# Altium project rmi-hw.PrjPcb
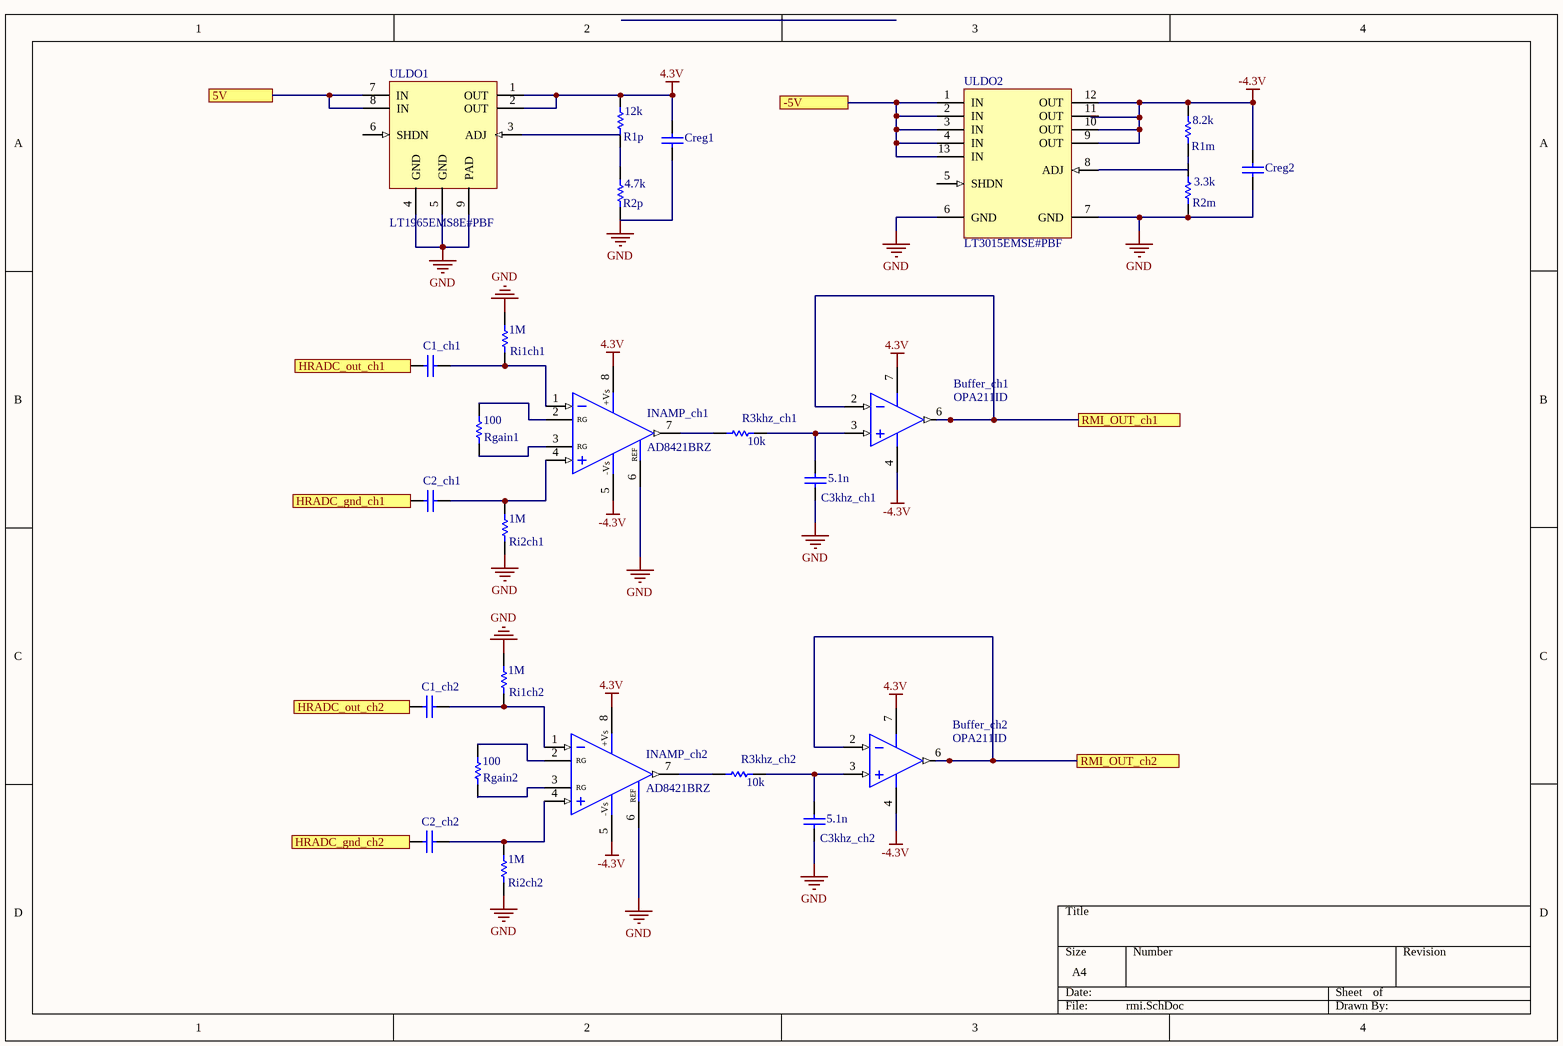
[diagram p0: rmi.SchDoc]
1 sheet, 26 parts. Net scope: flat (ports and power ports of the same name join across sheets).

## Sheet rmi.SchDoc
size A4; SheetNumber: 1; SheetTotal: 1

### Parts
Buffer_ch1  OPA211ID  [SOIC_8_N]
Buffer_ch2  OPA211ID  [SOIC_8_N]
C1_ch1  Cap_Ceram_0603  [CAP_CERAM_0603]  (value not drawn)
C1_ch2  Cap_Ceram_0603  [CAP_CERAM_0603]  (value not drawn)
C2_ch1  Cap_Ceram_0603  [CAP_CERAM_0603]  (value not drawn)
C2_ch2  Cap_Ceram_0603  [CAP_CERAM_0603]  (value not drawn)
C3khz_ch1  value 5.1n  [CAP_CERAM_0603]  (hidden comment: Cap_Ceram_0603)
C3khz_ch2  value 5.1n  [CAP_CERAM_0603]  (hidden comment: Cap_Ceram_0603)
Creg1  Cap_Ceram_0603  [CAP_CERAM_0603]  (value not drawn)
Creg2  Cap_Ceram_0603  [CAP_CERAM_0603]  (value not drawn)
INAMP_ch1  AD8421BRZ  [SOIC_8_L]
INAMP_ch2  AD8421BRZ  [SOIC_8_L]
R1m  value 8.2k  [R_0603]  (hidden comment: Res_0603)
R1p  value 12k  [R_0603]  (hidden comment: Res_0603)
R2m  value 3.3k  [R_0603]  (hidden comment: Res_0603)
R2p  value 4.7k  [R_0603]  (hidden comment: Res_0603)
R3khz_ch1  value 10k  [R_0603]  (hidden comment: Res_0603)
R3khz_ch2  value 10k  [R_0603]  (hidden comment: Res_0603)
Rgain1  value 100  [R_0603]  (hidden comment: Res_0603)
Rgain2  value 100  [R_0603]  (hidden comment: Res_0603)
Ri1ch1  value 1M  [R_0603]  (hidden comment: Res_0603)
Ri1ch2  value 1M  [R_0603]  (hidden comment: Res_0603)
Ri2ch1  value 1M  [R_0603]  (hidden comment: Res_0603)
Ri2ch2  value 1M  [R_0603]  (hidden comment: Res_0603)
ULDO1  LT1965EMS8E#PBF  [MSOP8-EP3]
ULDO2  LT3015EMSE#PBF  [MSOP12-EP]

### Ports
5V, -5V, HRADC_gnd_ch1, HRADC_gnd_ch2, HRADC_out_ch1, HRADC_out_ch2, RMI_OUT_ch1, RMI_OUT_ch2

### Nets
4.3V: Buffer_ch1.7(V+) Buffer_ch2.7(V+) Creg1.2 INAMP_ch1.8(+Vs) INAMP_ch2.8(+Vs) R1p.2 ULDO1.1(OUT) ULDO1.2(OUT)
-4.3V: Buffer_ch1.4(V-) Buffer_ch2.4(V-) Creg2.2 INAMP_ch1.5(-Vs) INAMP_ch2.5(-Vs) R1m.2 ULDO2.9(OUT) ULDO2.10(OUT) ULDO2.12(OUT)
GND: C3khz_ch1.1 C3khz_ch2.1 Creg1.1 Creg2.1 INAMP_ch1.6(REF) INAMP_ch2.6(REF) R2m.1 R2p.1 Ri1ch1.2 Ri1ch2.2 Ri2ch1.1 Ri2ch2.1 ULDO1.4(GND) ULDO1.5(GND) ULDO1.9(PAD) ULDO2.6(GND) ULDO2.7(GND)
NetBuffer_ch1_2: Buffer_ch1.2(IN-) Buffer_ch1.6(OUT) ; port RMI_OUT_ch1
NetBuffer_ch1_3: Buffer_ch1.3(IN+) C3khz_ch1.2 R3khz_ch1.2
NetBuffer_ch2_2: Buffer_ch2.2(IN-) Buffer_ch2.6(OUT) ; port RMI_OUT_ch2
NetBuffer_ch2_3: Buffer_ch2.3(IN+) C3khz_ch2.2 R3khz_ch2.2
NetC1_ch1_1: C1_ch1.1 ; port HRADC_out_ch1
NetC1_ch1_2: C1_ch1.2 INAMP_ch1.1(-IN) Ri1ch1.1
NetC1_ch2_1: C1_ch2.1 ; port HRADC_out_ch2
NetC1_ch2_2: C1_ch2.2 INAMP_ch2.1(-IN) Ri1ch2.1
NetC2_ch1_1: C2_ch1.1 ; port HRADC_gnd_ch1
NetC2_ch1_2: C2_ch1.2 INAMP_ch1.4(+IN) Ri2ch1.2
NetC2_ch2_1: C2_ch2.1 ; port HRADC_gnd_ch2
NetC2_ch2_2: C2_ch2.2 INAMP_ch2.4(+IN) Ri2ch2.2
NetINAMP_ch1_2: INAMP_ch1.2(RG) Rgain1.2
NetINAMP_ch1_3: INAMP_ch1.3(RG) Rgain1.1
NetINAMP_ch1_7: INAMP_ch1.7(Vout) R3khz_ch1.1
NetINAMP_ch2_2: INAMP_ch2.2(RG) Rgain2.2
NetINAMP_ch2_3: INAMP_ch2.3(RG) Rgain2.1
NetINAMP_ch2_7: INAMP_ch2.7(Vout) R3khz_ch2.1
NetR1m_1: R1m.1 R2m.2
NetR1p_1: R1p.1 R2p.2
NetULDO1_7: ULDO1.7(IN) ULDO1.8(IN) ; port 5V
NetULDO2_1: ULDO2.1(IN) ULDO2.2(IN) ULDO2.3(IN) ULDO2.4(IN) ULDO2.13(IN) ; port -5V

Not connected (* = marked no-connect by the designer): Buffer_ch1 1(NC) 5(NC) 8(NC); Buffer_ch2 1(NC) 5(NC) 8(NC); ULDO1 3(ADJ) 6(SHDN); ULDO2 5(SHDN) 8(ADJ) 11(OUT)

### Library data of the parts
Buffer_ch1 Buffer_ch2 = OPA211ID: 1.1nV/√Hz Noise, Low Power, Precision Operational Amplifier; Manufacturer: Texas Instruments; PackageReference: SOIC_8; ComponentLink1Description: Datasheet; ComponentLink1URL: http://www.ti.com/lit/ds/symlink/opa211.pdf; PartNumber: OPA211ID; VendorLink: http://www.digikey.com/product-detail/en/OPA211IDR/OPA211IDR-ND/2047464
C1_ch1 C1_ch2 C2_ch1 C2_ch2 C3khz_ch1 C3khz_ch2 Creg1 Creg2 = Cap_Ceram_0603: Ceramic Chip Capacitor SMD 0603; PackageReference: 0603; ComponentLink1Description: Datasheet
INAMP_ch1 INAMP_ch2 = AD8421BRZ: 3 nV/√Hz, Low Power  Instrumentation Amplifier; Manufacturer: Analog Devices; VendorLink: http://www.digikey.com/product-detail/en/analog-devices-inc/AD8421BRZ/AD8421BRZ-ND/3340513; PartNumber: AD8421BRZ; PackageReference: SOIC_8; ComponentLink1Description: Datasheet; ComponentLink1URL: http://www.analog.com/media/en/technical-documentation/data-sheets/AD8421.pdf
R1m R1p R2m R2p R3khz_ch1 R3khz_ch2 Rgain1 Rgain2 Ri1ch1 Ri1ch2 Ri2ch1 Ri2ch2 = Res_0603: Chip Resistor SMD 0603; ComponentLink1Description: Datasheet; PackageReference: 0603
ULDO1 = LT1965EMS8E#PBF: 1.1A, Low Noise,  Low Dropout Linear Regulator; Manufacturer: Linear Technology; PackageReference: MSOP_8; ComponentLink1Description: Datasheet; ComponentLink1URL: http://cds.linear.com/docs/en/datasheet/1965fb.pdf; PartNumber: LT1965EMS8E#PBF; VendorLink: http://www.digikey.com/product-detail/en/LT1965EMS8E%23PBF/LT1965EMS8E%23PBF-ND/1730226
ULDO2 = LT3015EMSE#PBF: 1.5A, Low Noise,  Negative Linear Regulator  with Precision Current Limit; Manufacturer: Linear Technology; PackageReference: MSOP_12; ComponentLink1Description: Datasheet; ComponentLink1URL: http://cds.linear.com/docs/en/datasheet/3015fb.pdf; PartNumber: LT3015EMSE#PBF; VendorLink: http://www.digikey.com/product-detail/en/LT3015EMSE%23PBF/LT3015EMSE%23PBF-ND/2752758